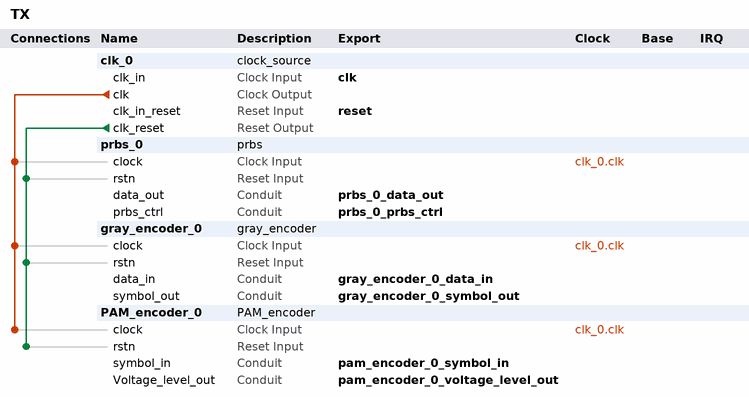
[diagram p0: system contents]
# Platform Designer (Qsys) system TX, Cyclone V 5CSEMA5F31C6
# Parameters at their usual value, and those the tool derives, are not listed.
package require -exact qsys 22.1
create_system TX
set_project_property DEVICE_FAMILY {Cyclone V}
set_project_property DEVICE 5CSEMA5F31C6

add_instance clk_0 clock_source 22.1
set_instance_parameter_value clk_0 clockFrequency 100000000

add_instance prbs_0 prbs 1.0
set_instance_parameter_value prbs_0 SEED 1756177695

add_instance gray_encoder_0 gray_encoder 1.0

add_instance PAM_encoder_0 PAM_encoder 1.0
set_instance_parameter_value PAM_encoder_0 SIGNAL_RESOLUTION 8
set_instance_parameter_value PAM_encoder_0 SYMBOL_SEPERATION 56

# connections
add_connection clk_0.clk gray_encoder_0.clock clock
add_connection clk_0.clk PAM_encoder_0.clock clock
add_connection clk_0.clk prbs_0.clock clock
add_connection clk_0.clk_reset gray_encoder_0.rstn reset
add_connection clk_0.clk_reset PAM_encoder_0.rstn reset
add_connection clk_0.clk_reset prbs_0.rstn reset

# exported interfaces
add_interface clk clock sink
set_interface_property clk EXPORT_OF clk_0.clk_in
add_interface gray_encoder_0_data_in conduit end
set_interface_property gray_encoder_0_data_in EXPORT_OF gray_encoder_0.data_in
add_interface gray_encoder_0_symbol_out conduit end
set_interface_property gray_encoder_0_symbol_out EXPORT_OF gray_encoder_0.symbol_out
add_interface pam_encoder_0_symbol_in conduit end
set_interface_property pam_encoder_0_symbol_in EXPORT_OF PAM_encoder_0.symbol_in
add_interface pam_encoder_0_voltage_level_out conduit end
set_interface_property pam_encoder_0_voltage_level_out EXPORT_OF PAM_encoder_0.Voltage_level_out
add_interface prbs_0_data_out conduit end
set_interface_property prbs_0_data_out EXPORT_OF prbs_0.data_out
add_interface prbs_0_prbs_ctrl conduit end
set_interface_property prbs_0_prbs_ctrl EXPORT_OF prbs_0.prbs_ctrl
add_interface reset reset sink
set_interface_property reset EXPORT_OF clk_0.clk_in_reset

set_interconnect_requirement {$system} qsys_mm.clockCrossingAdapter HANDSHAKE
set_interconnect_requirement {$system} qsys_mm.enableEccProtection FALSE
set_interconnect_requirement {$system} qsys_mm.insertDefaultSlave FALSE
set_interconnect_requirement {$system} qsys_mm.maxAdditionalLatency 1

save_system TX.qsys
